# EAGLE design back_r3 (EAGLE 7.2.0)
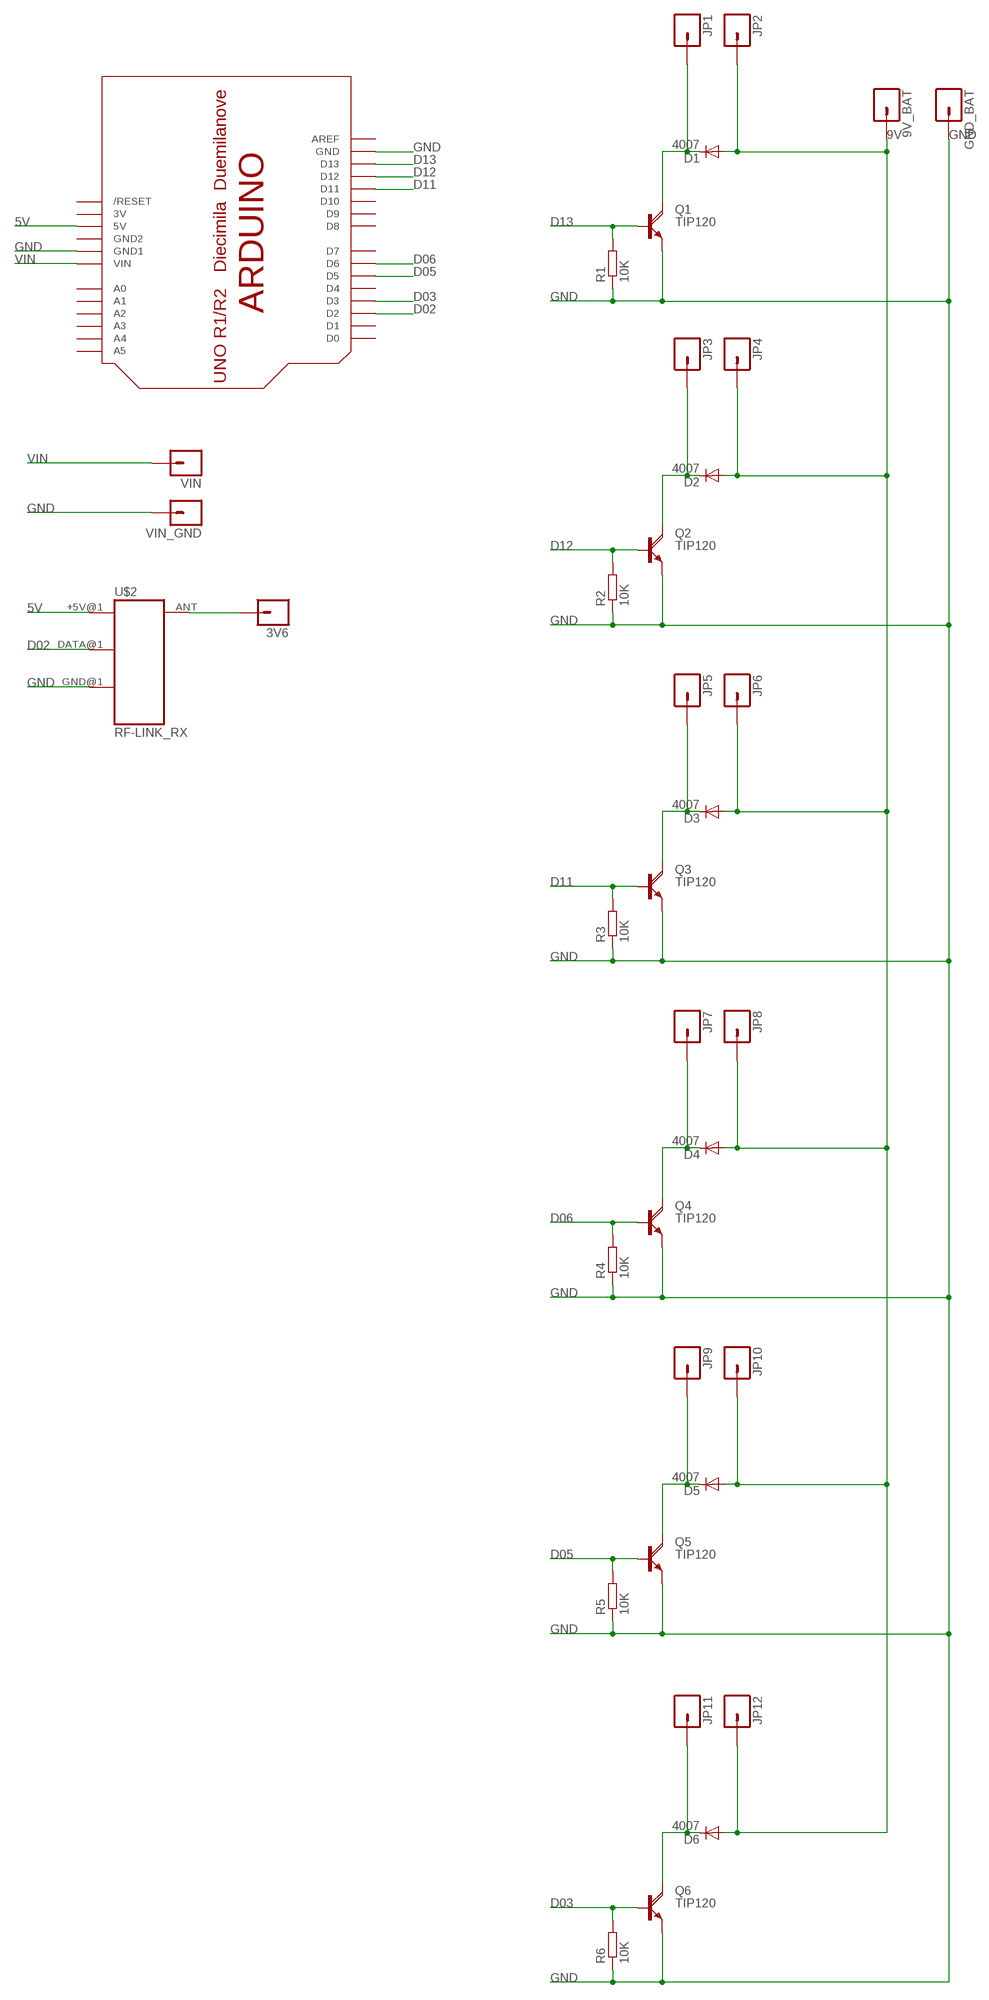
[diagram p0: schematic, sheet 1]

## Parts
3V6  M01PTH_LONGPAD  [1X01_LONGPAD]
9V_BAT  M01PTH_LONGPAD  [1X01_LONGPAD]
D1  4007  1N4004  [DO41-10]
D2  4007  1N4004  [DO41-10]
D3  4007  1N4004  [DO41-10]
D4  4007  1N4004  [DO41-10]
D5  4007  1N4004  [DO41-10]
D6  4007  1N4004  [DO41-10]
GND_BAT  M01PTH_LONGPAD  [1X01_LONGPAD]
JP1  M01PTH_LONGPAD  [1X01_LONGPAD]
JP2  M01PTH_LONGPAD  [1X01_LONGPAD]
JP3  M01PTH_LONGPAD  [1X01_LONGPAD]
JP4  M01PTH_LONGPAD  [1X01_LONGPAD]
JP5  M01PTH_LONGPAD  [1X01_LONGPAD]
JP6  M01PTH_LONGPAD  [1X01_LONGPAD]
JP7  M01PTH_LONGPAD  [1X01_LONGPAD]
JP8  M01PTH_LONGPAD  [1X01_LONGPAD]
JP9  M01PTH_LONGPAD  [1X01_LONGPAD]
JP10  M01PTH_LONGPAD  [1X01_LONGPAD]
JP11  M01PTH_LONGPAD  [1X01_LONGPAD]
JP12  M01PTH_LONGPAD  [1X01_LONGPAD]
Q1  TIP120  [TO220AH]
Q2  TIP120  [TO220AH]
Q3  TIP120  [TO220AH]
Q4  TIP120  [TO220AH]
Q5  TIP120  [TO220AH]
Q6  TIP120  [TO220AH]
R1  10K  R-EU_0207/10  [0207/10]
R2  10K  R-EU_0207/10  [0207/10]
R3  10K  R-EU_0207/10  [0207/10]
R4  10K  R-EU_0207/10  [0207/10]
R5  10K  R-EU_0207/10  [0207/10]
R6  10K  R-EU_0207/10  [0207/10]
U$1  ARDUINO-BPLACE  [ARDUINO-BPLACE]
U$2  RF-LINK_RX  [RF-LINK_RX]
VIN  M01PTH_LONGPAD  [1X01_LONGPAD]
VIN_GND  M01PTH_LONGPAD  [1X01_LONGPAD]

## Nets
5V: U$1.5V U$2.+5V@1(+5V)
9V: 9V_BAT.1 D1.A D2.A D3.A D4.A D5.A D6.A JP2.1 JP4.1 JP6.1 JP8.1 JP10.1 JP12.1
D02: U$1.D2 U$2.DATA@1(DATA)
D03: Q6.B R6.2 U$1.D3
D05: Q5.B R5.2 U$1.D5
D06: Q4.B R4.2 U$1.D6
D11: Q3.B R3.2 U$1.D11
D12: Q2.B R2.2 U$1.D12
D13: Q1.B R1.2 U$1.D13
GND: GND_BAT.1 Q1.E Q2.E Q3.E Q4.E Q5.E Q6.E R1.1 R2.1 R3.1 R4.1 R5.1 R6.1 U$1.GND U$1.GND1 U$2.GND@1(GND) VIN_GND.1
N$1: 3V6.1 U$2.ANT
N$2: D1.C JP1.1 Q1.C
N$4: D2.C JP3.1 Q2.C
N$6: D3.C JP5.1 Q3.C
N$8: D4.C JP7.1 Q4.C
N$10: D5.C JP9.1 Q5.C
N$12: D6.C JP11.1 Q6.C
VIN: U$1.VIN VIN.1
Unconnected: U$1.A0 U$1.A1 U$1.A2 U$1.A3 U$1.A4 U$1.A5 U$1.AREF U$1.D0 U$1.D1 U$1.D4 U$1.D7 U$1.D8 U$1.D9 U$1.D10 U$1.RESET(/RESET)

## Power pins joined to a net without a drawn wire
3V: U$1.3V
GND2: U$1.GND2

## Library data of the parts
3V6 9V_BAT GND_BAT JP1-JP12 VIN VIN_GND = SparkFun-Connectors:M01: Header 1 Standard 1-pin 0.1" header. Use with straight break away headers (SKU : PRT-00116), right angle break away headers (PRT-00553), swiss pins (PRT-00743), machine pins (PRT-00117), and female headers (PRT-00115).
D1-D6 = adafruit:1N4004: DIODE General purpose 1N400x type rectifier (With bigger pads) http://www.ladyada.net/library/pcb/eaglelibrary.html
Q1-Q6 = transistor-power:TIP120: NPN DARLINGTON TRANSISTOR
R1-R6 = resistor:R-EU_: RESISTOR, European symbol
U$1 = adafruit:ARDUINO: Arduino Diecimila/Duemilanove Make a shield with ease, this package has all the named pins as well as the two mounting drill holes and an outline of the USB and DC power connector. The outline is on the DIMENSION layer, so if your board house uses it they will cut the outline to match. http://www.ladyada.net/library/pcb/eaglelibrary.html
U$2 = SparkFun-RF:RF-LINK_RX: RF Link receivers- WRL-8947, 8948, 8949, 8950, 10532, 10533

## Board
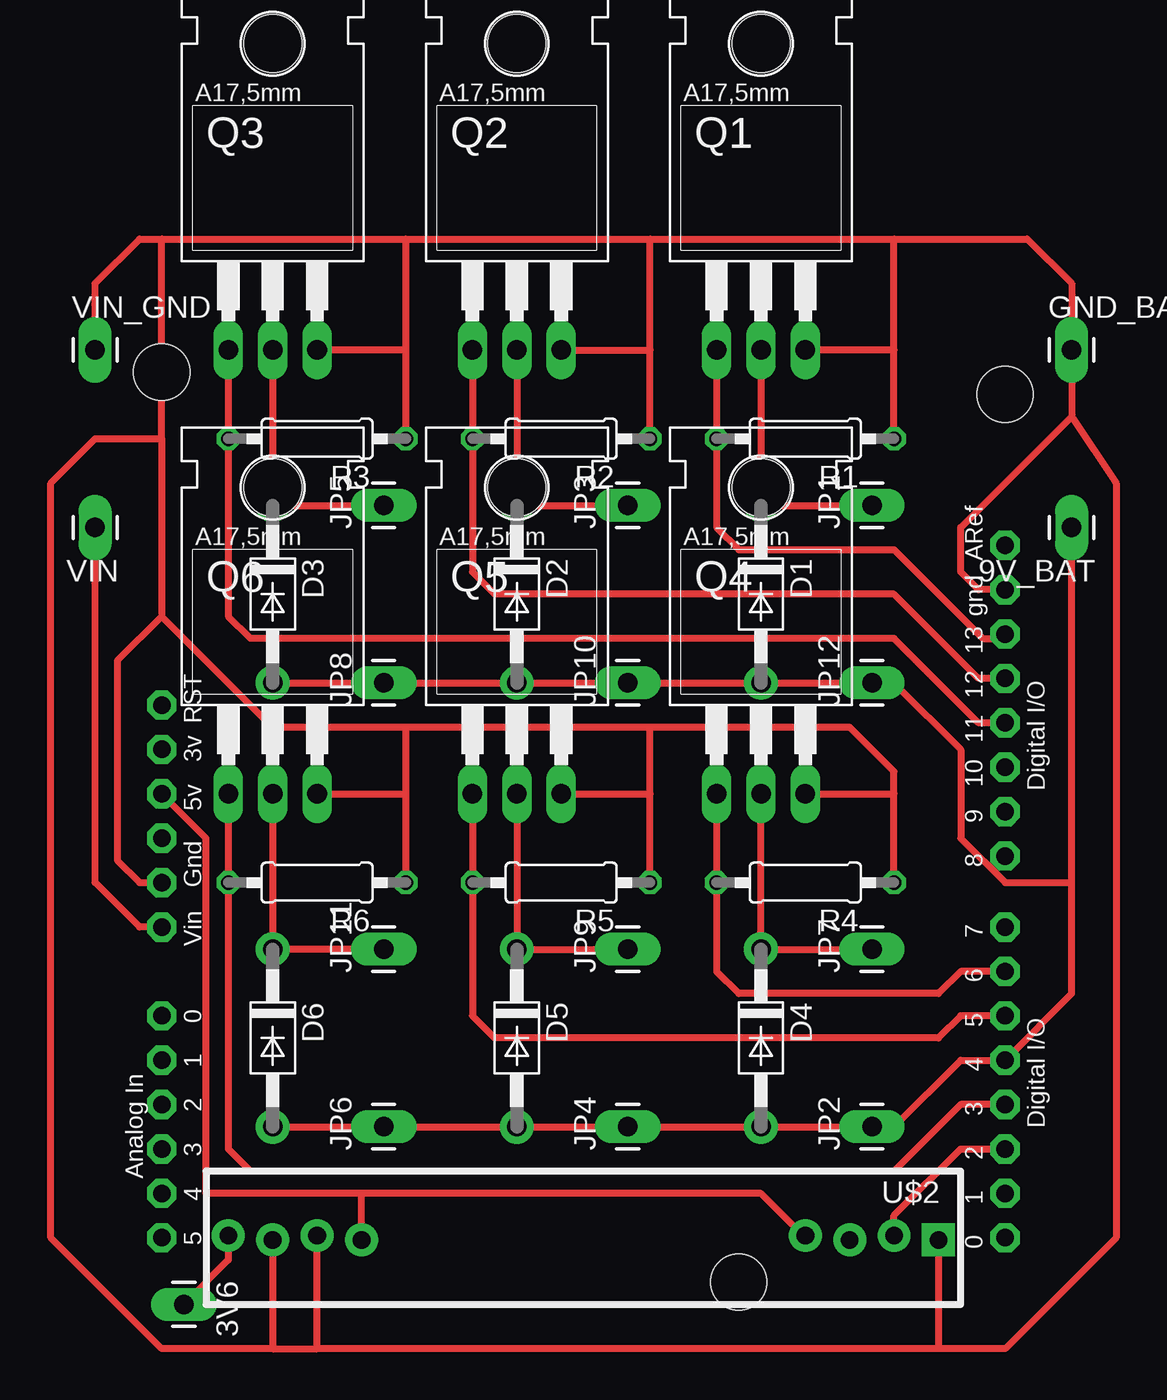
[diagram p1: board, top side]
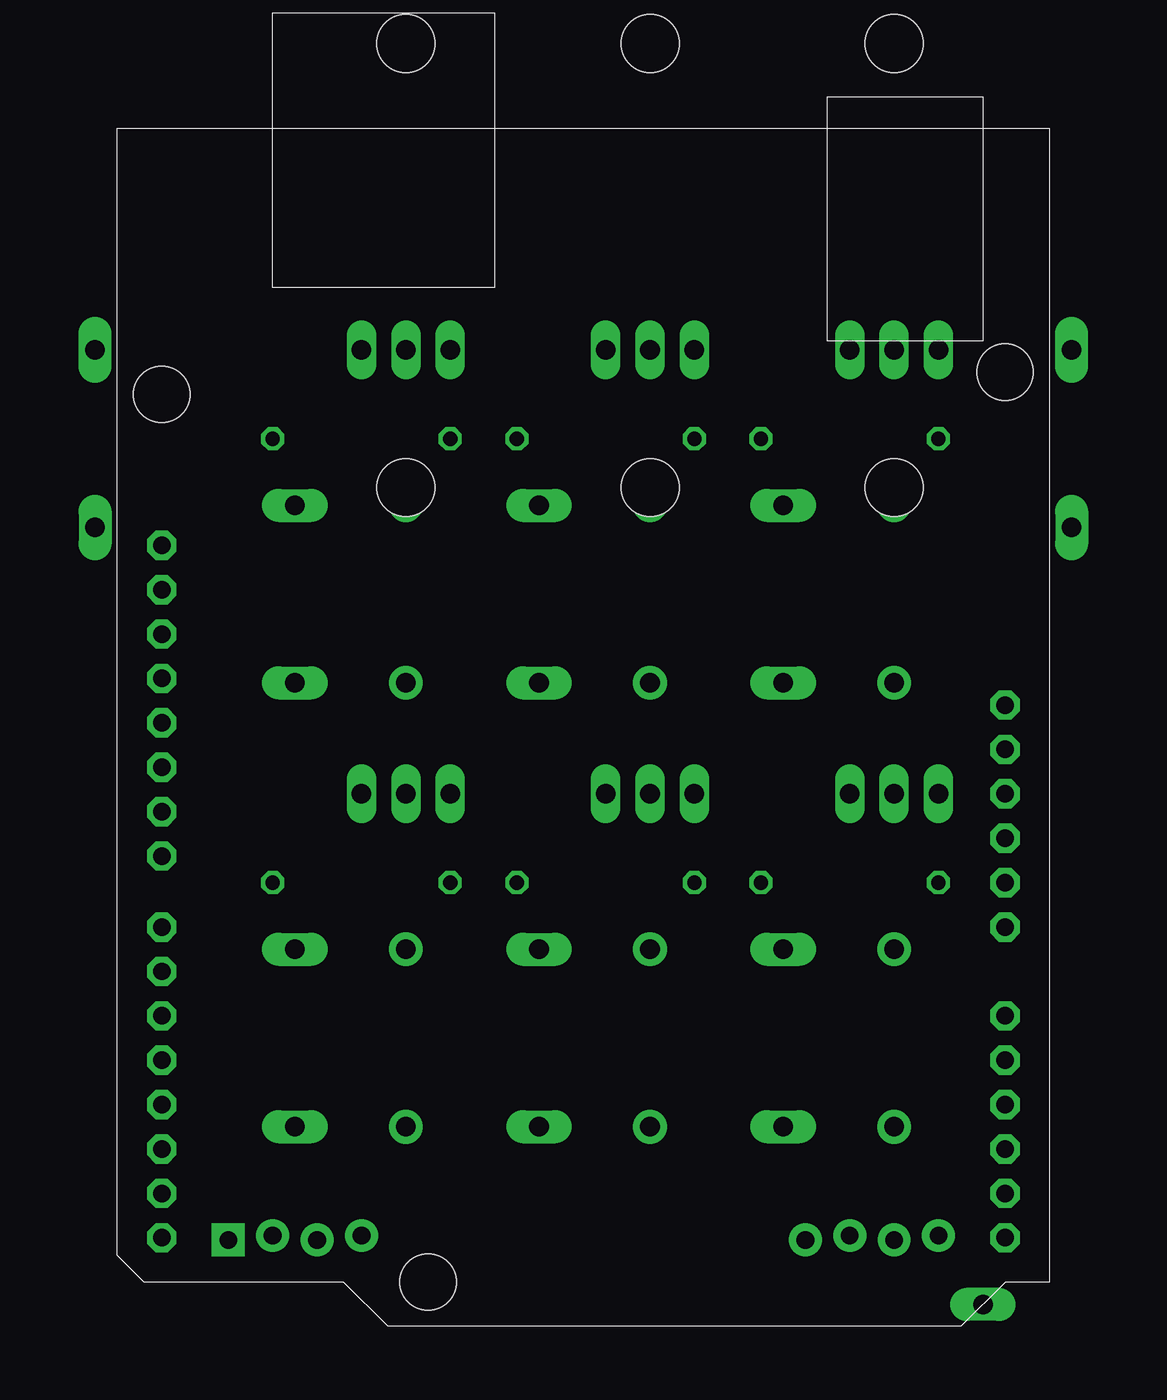
[diagram p2: board, bottom side, seen from below]

No outline drawn. Coordinates in mm, seen from the top.
Copper layers (1*16): Top 0.035mm / dielectric 1.5mm / Bottom 0.035mm
Design rules "default": minimum track width 10mil, minimum drill 24mil, track to track 8mil, track to pad 8mil, pad to pad 8mil, via to via 8mil, smd to smd 8mil, copper to edge 40mil, drill to drill 8mil, minimum pad ring 10mil, minimum via ring 8mil, stop-mask expansion 4mil, vias tented up to drill 0mil, thermal gap 10mil

### Footprints (pad centres in the part's own frame; a part is rotated, then mirrored left to right if it is on the bottom)
1X01_LONGPAD = drill 1.118 pad 1.88 long: 1 0,0
DO41-10 = drill 1.118 pad 1.93: A 5.08,0; C -5.08,0
TO220AH = drill 1.118 long: B -2.54,-6.35; C 0,-6.35; E 2.54,-6.35 | hole 3.302: 0,11.176
0207/10 = drill 0.813 octagon: 1 -5.08,0; 2 5.08,0
ARDUINO-BPLACE = drill 1 pad 1.676 octagon: 3V 35.56,2.54; 5V 38.1,2.54; A0 50.8,2.54; A1 53.34,2.54; A2 55.88,2.54; A3 58.42,2.54; A4 60.96,2.54; A5 63.5,2.54; AREF 23.876,50.8; D0 63.5,50.8; D1 60.96,50.8; D2 58.42,50.8; D3 55.88,50.8; D4 53.34,50.8; D5 50.8,50.8; D6 48.26,50.8; D7 45.72,50.8; D8 41.656,50.8; D9 39.116,50.8; D10 36.576,50.8; D11 34.036,50.8; D12 31.496,50.8; D13 28.956,50.8; GND 26.416,50.8; GND1 43.18,2.54; GND2 40.64,2.54; RESET 33.02,2.54; VIN 45.72,2.54 | hole 3.2: 15.24,50.8; 66.04,35.56; 13.97,2.54
RF-LINK_RX = drill 1.016 pad 1.88: +5V@1 7.62,-0.127; +5V@2 33.02,0.127; ANT 40.64,-0.127; DATA@1 2.54,-0.127; DATA@2 5.08,0.127; GND@2 35.56,-0.127; GND@3 38.1,0.127 | drill 1.016 pad 1.88 square: GND@1 0,0.127

### Placement (x,y rotation side)
3V6  8.89,3.81 270 top
9V_BAT  59.69,48.26 180 top
D1  41.91,44.45 270 top
D2  27.94,44.45 270 top
D3  13.97,44.45 270 top
D4  41.91,19.05 270 top
D5  27.94,19.05 270 top
D6  13.97,19.05 270 top
GND_BAT  59.69,58.42 0 top
JP1  48.26,49.53 90 top
JP2  48.26,13.97 90 top
JP3  34.29,49.53 90 top
JP4  34.29,13.97 90 top
JP5  20.32,49.53 90 top
JP6  20.32,13.97 90 top
JP7  48.26,24.13 90 top
JP8  20.32,39.37 90 top
JP9  34.29,24.13 90 top
JP10  34.29,39.37 90 top
JP11  20.32,24.13 90 top
JP12  48.26,39.37 90 top
Q1  41.91,64.77 0 top
Q2  27.94,64.77 0 top
Q3  13.97,64.77 0 top
Q4  41.91,39.37 0 top
Q5  27.94,39.37 0 top
Q6  13.97,39.37 0 top
R1  44.45,53.34 180 top
R2  30.48,53.34 180 top
R3  16.51,53.34 180 top
R4  44.45,27.94 180 top
R5  30.48,27.94 180 top
R6  16.51,27.94 180 top
U$1  5.08,71.12 270 top
U$2  52.07,7.62 180 top
VIN  3.81,48.26 180 top
VIN_GND  3.81,58.42 0 top

### Tracks (layer width: path | path; a pad name or v marks a point on that pad's centre or on a via)
5V
  Top 0.406: U$2.+5V@1 44.45,7.62 41.91,10.16 19.05,10.16 | 19.05,10.16 10.16,10.16 10.16,30.48 U$1.5V | 19.05,7.62 19.05,10.16
9V
  Top 0.406: D3.A JP8.1 D2.A JP10.1 D1.A JP12.1 49.53,39.37 53.34,35.56 53.34,30.48 55.88,27.94 59.69,27.94 | D6.A JP6.1 D5.A JP4.1 D4.A JP2.1 49.53,13.97 53.34,17.78 55.88,17.78 59.69,21.59 59.69,27.94 | 59.69,27.94 9V_BAT.1
D02
  Top 0.406: U$2.DATA@1 49.53,8.89 53.34,12.7 U$1.D2
D03
  Top 0.406: U$1.D3 53.34,15.24 49.53,11.43 12.7,11.43 11.43,12.7 R6.2 Q6.B
D05
  Top 0.406: Q5.B R5.2 25.4,20.32 26.67,19.05 52.07,19.05 53.34,20.32 U$1.D5
D06
  Top 0.406: Q4.B R4.2 39.37,22.86 40.64,21.59 52.07,21.59 53.34,22.86 U$1.D6
D11
  Top 0.406: U$1.D11 54.36,37.08 49.53,41.91 12.7,41.91 11.43,43.18 R3.2 Q3.B
D12
  Top 0.406: U$1.D12 54.36,39.62 49.53,44.45 26.67,44.45 25.4,45.72 R2.2 Q2.B
D13
  Top 0.406: U$1.D13 55.63,41.91 54.61,41.91 49.53,46.99 40.64,46.99 39.37,48.26 R1.2 Q1.B
GND
  Top 0.406: VIN_GND.1 3.81,62.23 6.35,64.77 7.62,64.77 | 7.62,64.77 21.59,64.77 | 21.59,64.77 35.56,64.77 | 35.56,64.77 49.53,64.77 | 49.53,64.77 57.15,64.77 59.69,62.23 GND_BAT.1 59.69,54.61 | 7.62,53.34 7.62,64.77 | 7.62,43.18 13.97,36.83 21.59,36.83 | 35.56,36.83 46.99,36.83 49.53,34.29 49.53,33.02 | 35.56,36.83 21.59,36.83 | 59.69,54.61 62.23,50.8 62.23,7.62 55.88,1.27 52.07,1.27 | 52.07,1.27 16.51,1.27 | 13.97,1.27 7.62,1.27 1.27,7.62 1.27,50.8 3.81,53.34 7.62,53.34 | 7.62,53.34 7.62,43.18 | 7.62,43.18 5.08,40.64 5.08,29.21 6.35,27.94 U$1.GND1 | U$2.GND@1 52.07,1.27 | U$1.GND 54.36,44.7 53.34,45.72 53.34,48.26 59.69,54.61 | 13.97,7.62 13.97,1.27 | 13.97,1.27 16.51,1.27 | 16.51,1.27 16.51,7.62 | R3.1 21.59,58.42 | 21.59,58.42 Q3.E | 21.59,58.42 21.59,64.77 | R2.1 35.56,58.42 | Q2.E 35.56,58.42 | 35.56,58.42 35.56,64.77 | Q1.E 49.53,58.42 R1.1 49.53,64.77 | R6.1 21.59,33.02 | Q6.E 21.59,33.02 | 21.59,33.02 21.59,36.83 | R5.1 35.56,33.02 | Q5.E 35.56,33.02 | 35.56,33.02 35.56,36.83 | R4.1 49.53,33.02 | Q4.E 49.53,33.02
N$1
  Top 0.406: U$2.ANT 11.43,6.35 3V6.1
N$2
  Top 0.406: JP1.1 D1.C Q1.C
N$4
  Top 0.406: Q2.C D2.C JP3.1
N$6
  Top 0.406: JP5.1 D3.C Q3.C
N$8
  Top 0.406: JP7.1 D4.C Q4.C
N$10
  Top 0.406: JP9.1 D5.C Q5.C
N$12
  Top 0.406: JP11.1 D6.C Q6.C
VIN
  Top 0.406: U$1.VIN 6.35,25.4 3.81,27.94 VIN.1